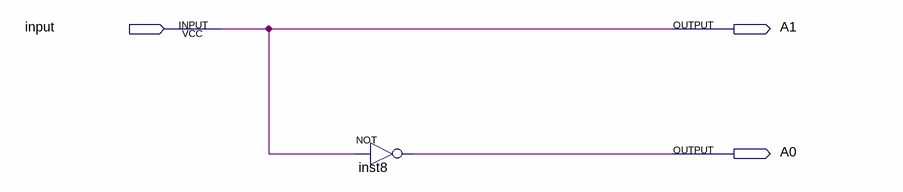
[diagram p0: schematic sheet]
// Quartus schematic My_12.bdf as structural Verilog: 1 symbols, 3 pins
module My_12 (
  input  \input ,
  output A1,
  output A0
);

  not inst8 (A0, \input );

  assign A1 = \input ;
endmodule
